# Altium schematic sheet Debug_switch.SchDoc
size A4; SheetNumber: 6; SheetTotal: 7
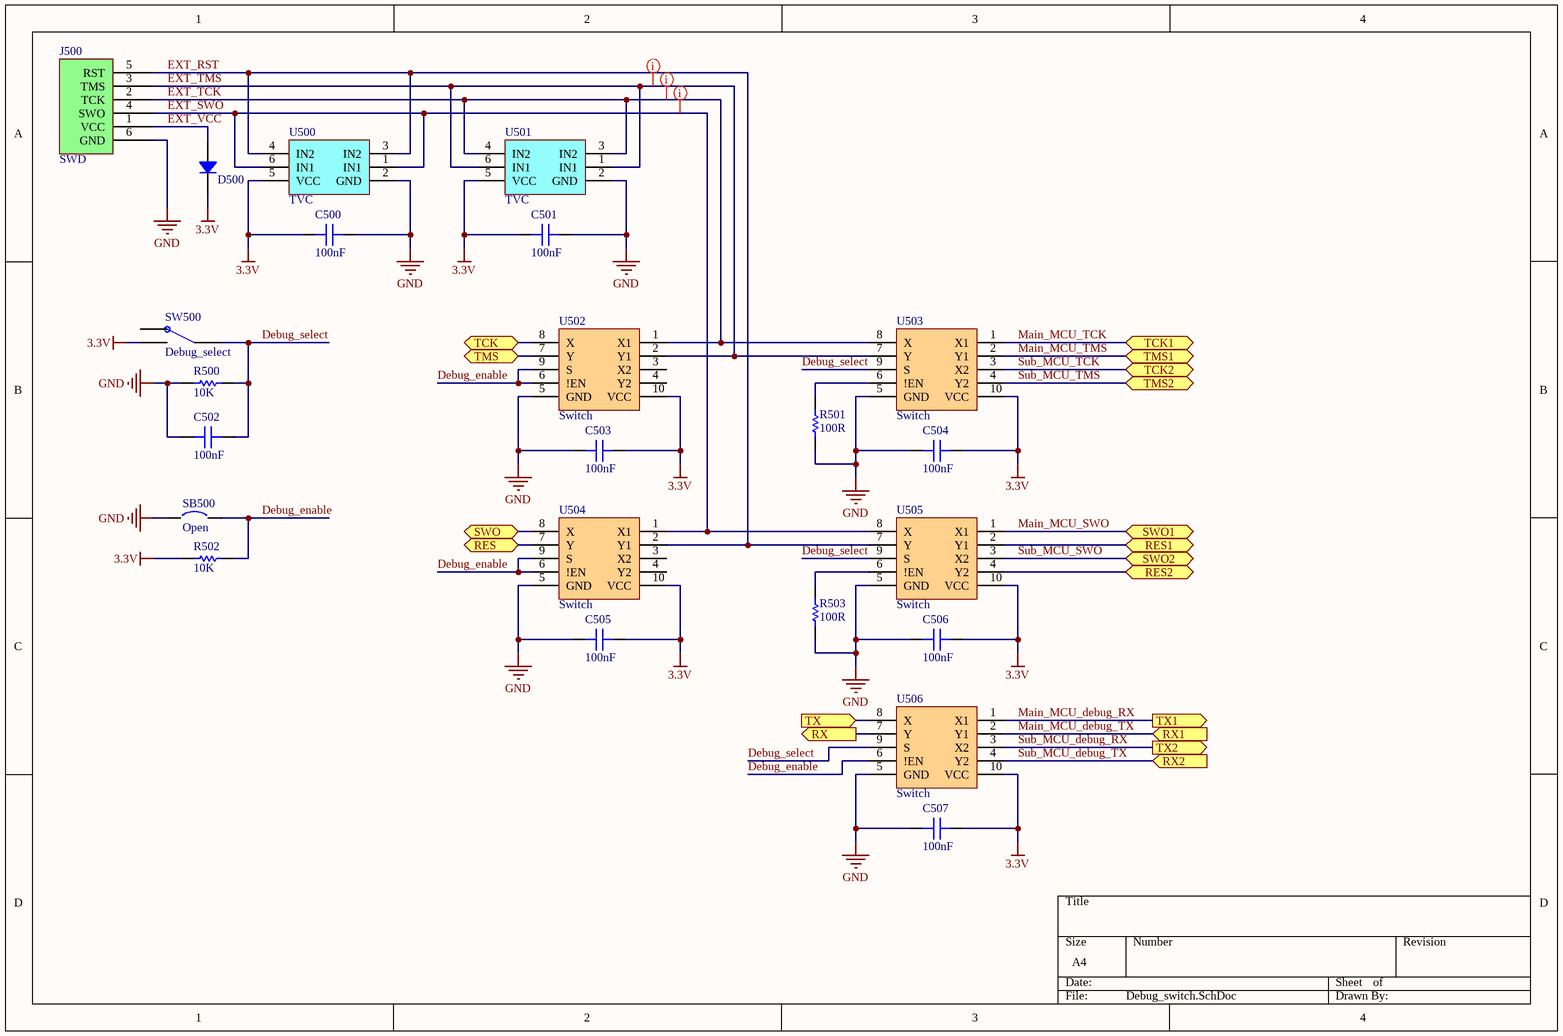
[diagram p0: Debug_switch.SchDoc]

## Parts
C500  100nF  [CAP 0603]
C501  100nF  [CAP 0603]
C502  100nF  [CAP 0603]
C503  100nF  [CAP 0603]
C504  100nF  [CAP 0603]
C505  100nF  [CAP 0603]
C506  100nF  [CAP 0603]
C507  100nF  [CAP 0603]
D500  (no value)  [Bourns DO214AC SMA - duplicate]
J500  SWD  [AMPHENOL_20021121-00006C1LF]
R500  10K  [RES 0603]
R501  100R  [RES 0603]
R502  10K  [RES 0603]
R503  100R  [RES 0603]
SB500  Open  [SB_0603]
SW500  Debug_select  [SW_JS202011JCQN]
U500  TVC  [SOT95P275X110-6N - duplicate - duplicate]
U501  TVC  [SOT95P275X110-6N - duplicate - duplicate]
U502  Switch  [PI3USB221AZUAEX]
U503  Switch  [PI3USB221AZUAEX]
U504  Switch  [PI3USB221AZUAEX]
U505  Switch  [PI3USB221AZUAEX]
U506  Switch  [PI3USB221AZUAEX]

## Ports
RES1 (bidir, see Main_scheme[1C]), RES2 (bidir, see Main_scheme[1D]), RES (bidir, see Main_scheme[1C], ST_LINK[2B]), RX1 (in, see Main_scheme[1C]), RX2 (in, see Main_scheme[1D]), RX (out, see Main_scheme[1C], ST_LINK[2B]), SWO1 (bidir, see Main_scheme[1C]), SWO2 (bidir, see Main_scheme[1D]), SWO (bidir, see Main_scheme[1C], ST_LINK[2B]), TCK1 (bidir, see Main_scheme[1C]), TCK2 (bidir, see Main_scheme[1C]), TCK (bidir, see Main_scheme[1C], ST_LINK[2B]), TMS1 (bidir, see Main_scheme[1C]), TMS2 (bidir, see Main_scheme[1D]), TMS (bidir, see Main_scheme[1C], ST_LINK[3B]), TX1 (out, see Main_scheme[1C]), TX2 (out, see Main_scheme[1D]), TX (in, see Main_scheme[1C], ST_LINK[2B])

## Nets
3.3V: C500.1 C501.1 C503.2 C504.2 C505.2 C506.2 C507.2 D500.2 R502.1 SW500.3 U500.5(VCC) U501.5(VCC) U502.10(VCC) U503.10(VCC) U504.10(VCC) U505.10(VCC) U506.10(VCC)
GND: C500.2 C501.2 C502.1 C503.1 C504.1 C505.1 C506.1 C507.1 J500.6(GND) R500.1 R501.1 R503.1 SB500.1 U500.2(GND) U501.2(GND) U502.5(GND) U503.5(GND) U504.5(GND) U505.5(GND) U506.5(GND)
Debug_enable: R502.2 SB500.2 U502.6(!EN) U502.9(S) U504.6(!EN) U504.9(S) U506.6(!EN)
Debug_select: C502.2 R500.2 SW500.2 U503.9(S) U505.9(S) U506.9(S)
EXT_RST: J500.5(RST) U500.3(IN2) U500.4(IN2) U504.2(Y1) U505.7(Y)
EXT_SWO: J500.4(SWO) U500.1(IN1) U500.6(IN1) U504.1(X1) U505.8(X)
EXT_TCK: J500.2(TCK) U501.3(IN2) U501.4(IN2) U502.1(X1) U503.8(X)
EXT_TMS: J500.3(TMS) U501.1(IN1) U501.6(IN1) U502.2(Y1) U503.7(Y)
EXT_VCC: D500.1 J500.1(VCC)
Main_MCU_debug_RX: U506.1(X1) ; port TX1
Main_MCU_debug_TX: U506.2(Y1) ; port RX1
Main_MCU_SWO: U505.1(X1) ; port SWO1
Main_MCU_TCK: U503.1(X1) ; port TCK1
Main_MCU_TMS: U503.2(Y1) ; port TMS1
RES: U504.7(Y) ; port RES
RES1: U505.2(Y1) ; port RES1
RES2: U505.4(Y2) ; port RES2
RX: U506.7(Y) ; port RX
Sub_MCU_debug_RX: U506.3(X2) ; port TX2
Sub_MCU_debug_TX: U506.4(Y2) ; port RX2
Sub_MCU_SWO: U505.3(X2) ; port SWO2
Sub_MCU_TCK: U503.3(X2) ; port TCK2
Sub_MCU_TMS: U503.4(Y2) ; port TMS2
SWO: U504.8(X) ; port SWO
TCK: U502.8(X) ; port TCK
TMS: U502.7(Y) ; port TMS
TX: U506.8(X) ; port TX
NetR501_2: R501.2 U503.6(!EN)
NetR503_2: R503.2 U505.6(!EN)

Not connected (* = marked no-connect by the designer): SW500 1; U502 3(X2) 4(Y2); U504 3(X2) 4(Y2)

## Layout directives
net class EXT_SWD: EXT_SWO, EXT_TCK, EXT_TMS

## Library data of the parts
C500-C507 = Capacitor: SMT Capacitor; Value: 100nF
D500 = Diode: Rectifier Diode
J500 = SWD_connector
R500-R503 = Res: Resistor; Ordered by: Subcon; Published: 8-Jun-2000; Revision: July-2002: Re-released for DXP Platform.; Publisher: Altium Limited
  R500 R502: Value: 10K
  R501 R503: Value: 100R
SB500 = Circuit Breaker: Published: 24-Mar-1999; Revision: July-2002: Re-released for DXP Platform.; Publisher: Altium Limited
SW500 = Switch_1
U500 U501 = TVC_protection